# Altium project 555_Timer.PrjPcb
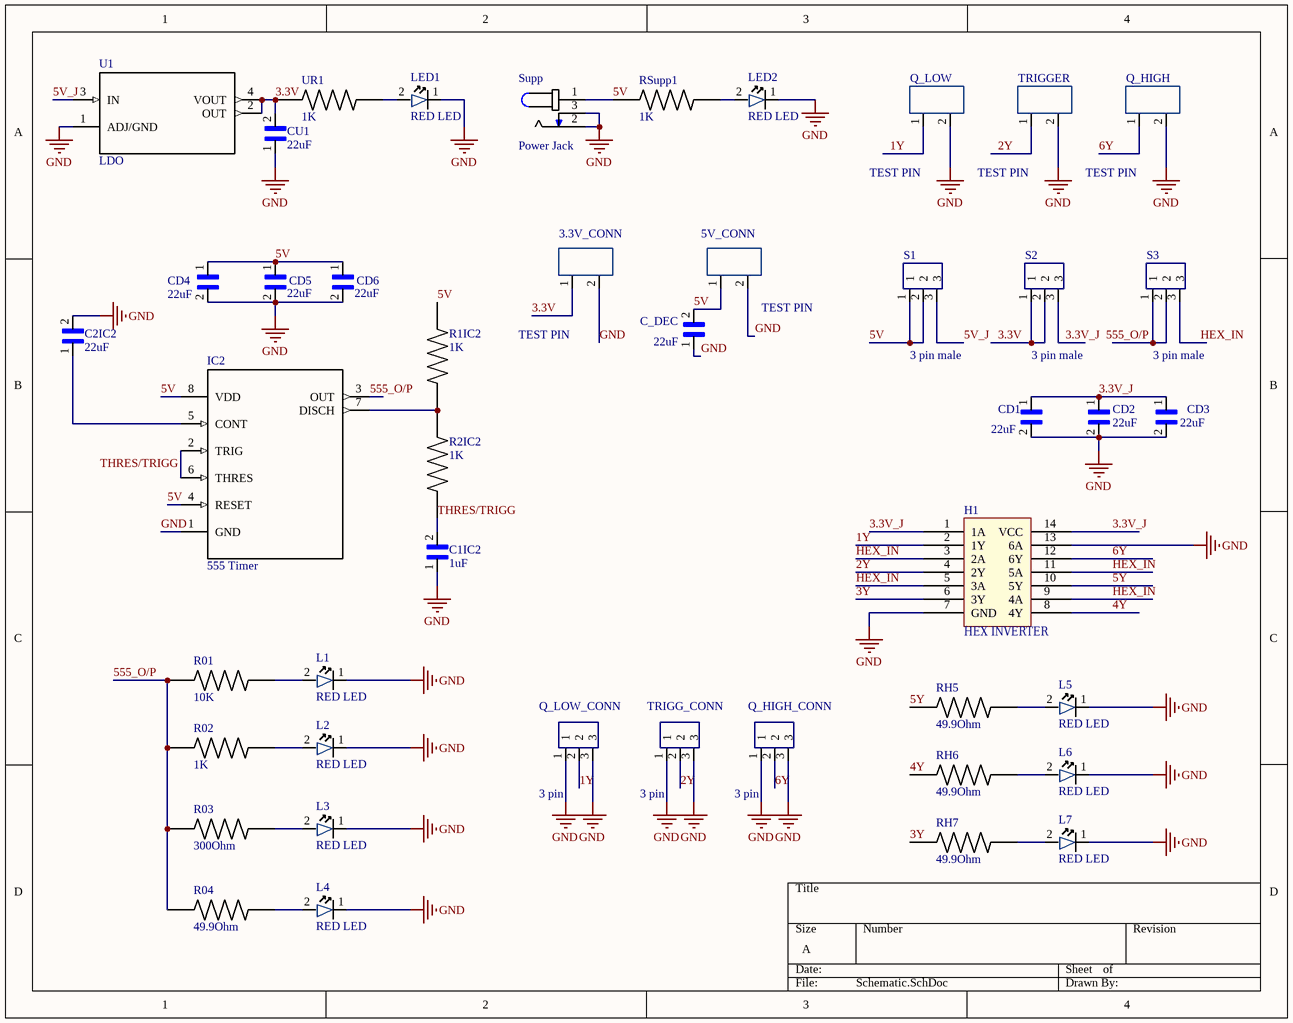
[diagram p0: Schematic.SchDoc]
1 sheet, 45 parts. Net scope: global (net labels, ports and power ports of the same name join across sheets).
Board file: PCB.PcbDoc

## Sheet Schematic.SchDoc
size A

### Parts
3.3V_CONN  TEST PIN  [TEST_PINS]
5V_CONN  TEST PIN  [TEST_PINS]
C1IC2  1uF  [1206_PASSIVE]
C2IC2  22uF  [1206_PASSIVE]
C_DEC  22uF  [1206_PASSIVE]
CD1  22uF  [1206_PASSIVE]
CD2  22uF  [1206_PASSIVE]
CD3  22uF  [1206_PASSIVE]
CD4  22uF  [1206_PASSIVE]
CD5  22uF  [1206_PASSIVE]
CD6  22uF  [1206_PASSIVE]
CU1  22uF  [1206_PASSIVE]
H1  ‎HEX INVERTER  [HEX]
IC2  555 Timer  [555]
L1  RED LED  [LED]
L2  RED LED  [LED]
L3  RED LED  [LED]
L4  RED LED  [LED]
L5  RED LED  [LED]
L6  RED LED  [LED]
L7  RED LED  [LED]
LED1  RED LED  [LED]
LED2  RED LED  [LED]
Q_HIGH  TEST PIN  [TEST_PINS]
Q_HIGH_CONN  3 pin  [3-PIN]
Q_LOW  TEST PIN  [TEST_PINS]
Q_LOW_CONN  3 pin  [3-PIN]
R01  10K  [1206_PASSIVE]
R1IC2  1K  [1206_PASSIVE]
R02  1K  [1206_PASSIVE]
R2IC2  1K  [1206_PASSIVE]
R03  300Ohm  [1206_PASSIVE]
R04  49.9Ohm  [1206_PASSIVE]
RH5  49.9Ohm  [1206_PASSIVE]
RH6  49.9Ohm  [1206_PASSIVE]
RH7  49.9Ohm  [1206_PASSIVE]
RSupp1  1K  [1206_PASSIVE]
S1  3 pin male  [3-PIN]
S2  3 pin male  [3-PIN]
S3  3 pin male  [3-PIN]
Supp  Power Jack  [Power Jack]
TRIGG_CONN  3 pin  [3-PIN]
TRIGGER  TEST PIN  [TEST_PINS]
U1  LDO  [LDO]
UR1  1K  [1206_PASSIVE]

### Nets
GND: 3.3V_CONN.2 5V_CONN.2 C1IC2.1 C2IC2.2 C_DEC.1 CD1.2 CD2.2 CD3.2 CD4.2 CD5.2 CD6.2 CU1.1 H1.7(GND) H1.13(6A) IC2.1(GND) L1.1 L2.1 L3.1 L4.1 L5.1 L6.1 L7.1 LED1.1 LED2.1 Q_HIGH.2 Q_HIGH_CONN.1 Q_HIGH_CONN.3 Q_LOW.2 Q_LOW_CONN.1 Q_LOW_CONN.3 Supp.2 Supp.3 TRIGG_CONN.1 TRIGG_CONN.3 TRIGGER.2 U1.1(ADJ/GND)
1Y: H1.2(1Y) Q_LOW.1 Q_LOW_CONN.2
2Y: H1.4(2Y) TRIGG_CONN.2 TRIGGER.1
3.3V: 3.3V_CONN.1 CU1.2 S2.1 S2.2 U1.2(OUT) U1.4(VOUT) UR1.2
3.3V_J: CD1.1 CD2.1 CD3.1 H1.1(1A) H1.14(VCC) S2.3
3Y: H1.6(3Y) RH7.1
4Y: H1.8(4Y) RH6.1
5V: 5V_CONN.1 C_DEC.2 CD4.1 CD5.1 CD6.1 IC2.4(RESET) IC2.8(VDD) R1IC2.2 RSupp1.1 S1.1 S1.2 Supp.1
5V_J: S1.3 U1.3(IN)
5Y: H1.10(5Y) RH5.1
6Y: H1.12(6Y) Q_HIGH.1 Q_HIGH_CONN.2
555_O/P: IC2.3(OUT) R01.1 R02.2 R03.1 R04.1
HEX_IN: H1.3(2A) H1.5(3A) H1.9(4A) H1.11(5A) S3.3
THRES/TRIGG: C1IC2.2 R2IC2.1
NetC2IC2_1: C2IC2.1 IC2.5(CONT)
NetIC2_2: IC2.2(TRIG) IC2.6(THRES)
NetIC2_7: IC2.7(DISCH) R1IC2.1 R2IC2.2
NetL1_2: L1.2 R01.2
NetL2_2: L2.2 R02.1
NetL3_2: L3.2 R03.2
NetL4_2: L4.2 R04.2
NetL5_2: L5.2 RH5.2
NetL6_2: L6.2 RH6.2
NetL7_2: L7.2 RH7.2
NetLED1_2: LED1.2 UR1.1
NetLED2_2: LED2.2 RSupp1.2
NetS3_1: S3.1 S3.2

### Notes on the sheet
- Labels drawn without touching a wire or pin: 555_O/P, THRES/TRIGG

### Library data of the parts
C1IC2 = C1206C105M4RACTU‎: CAP CER 1UF 16V X7R 1206; Digikey Part: ‎399-8150-1-ND‎; Component Link: https://www.digikey.com/product-detail/en/C1206C105M4RACTU/399-8150-1-ND/3471873/?itemSeq=303790193; Value: 1uF
C2IC2 C_DEC CD1-CD6 CU1 = CL31A226MOCLNNC‎: CAP CER 22UF 16V X5R 1206; Digikey Part: ‎1276-2728-1-ND‎; Component Link: https://www.digikey.com/product-detail/en/CL31A226MOCLNNC/1276-2728-1-ND/3890814/?itemSeq=303790208; Value: 22uF
H1 = ‎SN74ALVC14NSR‎: IC INVERTER SCHMITT 6CH 14SOP; Digikey Part: ‎296-28498-1-ND‎; Component Link: https://www.digikey.com/product-detail/en/SN74ALVC14NSR/296-28498-1-ND/2642575/?itemSeq=303790195; Value: Hex inverter
IC2 = ‎TLC555CDR‎: IC OSC SGL TIMER 2.1MHZ 8-SOIC; Digikey Part: ‎296-1336-1-ND‎; Component Link: https://www.digikey.com/product-detail/en/TLC555CDR/296-1336-1-ND/404959/?itemSeq=303790201; Value: 555 Timer
L1-L7 LED1 LED2 = ‎LTST-C150CKT: LED RED CLEAR 1206 SMD; Digikey Part: 160-1167-1-ND‎; Component Link: https://www.digikey.com/product-detail/en/LTST-C150CKT/160-1167-1-ND/269239/?itemSeq=303790203; Value: RED LED
Q_HIGH_CONN Q_LOW_CONN S1-S3 TRIGG_CONN = ‎PREC003SAAN-RC‎: CONN HEADER VERT 3POS 2.54MM; Value: 3-pin; Digikey Part: ‎S1012EC-03-ND‎; Component Link: https://www.digikey.com/product-detail/en/PREC003SAAN-RC/S1012EC-03-ND/2774851/?itemSeq=303790167
R01 = ‎RNCP1206FTD10K0‎: RES 10K OHM 1% 1/2W 1206; Value: 10K; Digikey Part: ‎RNCP1206FTD10K0CT-ND‎; Component Link: https://www.digikey.com/product-detail/en/RNCP1206FTD10K0/RNCP1206FTD10K0CT-ND/2240708/?itemSeq=303790164
R1IC2 R02 R2IC2 RSupp1 UR1 = ‎RNCP1206FTD1K00CT-ND‎: RES 1K OHM 1% 1/2W 1206; Digkiey Part: RNCP1206FTD1K00CT-ND‎; Component Link: https://www.digikey.com/product-detail/en/RNCP1206FTD1K00/RNCP1206FTD1K00CT-ND/2240675/?itemSeq=303790179; Value: 1K
R03 = RMCF1206JT300R‎: RES 300 OHM 5% 1/4W 1206; Value: 300; Component Link: https://www.digikey.com/product-detail/en/RMCF1206JT300R/RMCF1206JT300RCT-ND/1942776/?itemSeq=303790185; Digikey Part: RMCF1206JT300RCT-ND‎
R04 RH5-RH7 = RNCP1206FTD49R9‎: RES 49.9 OHM 1% 1/2W 1206; Value: 49.9; Digikey Part: RNCP1206FTD49R9CT-ND‎; Component Link: https://www.digikey.com/product-detail/en/RNCP1206FTD49R9/RNCP1206FTD49R9CT-ND/2240649/?itemSeq=303790171
Supp = ‎CP-102A-ND‎: CONN PWR JACK 2X5.5MM SOLDER; Digikey Part: CP-102A-ND‎; Component Link: https://www.digikey.com/product-detail/en/PJ-102A/CP-102A-ND/275425/?itemSeq=303790187; Value: Power Jack
U1 = AZ1117CH‎: IC REG LINEAR 3.3V 800MA SOT223